# Altium project ServoBoard2018.PrjPCB
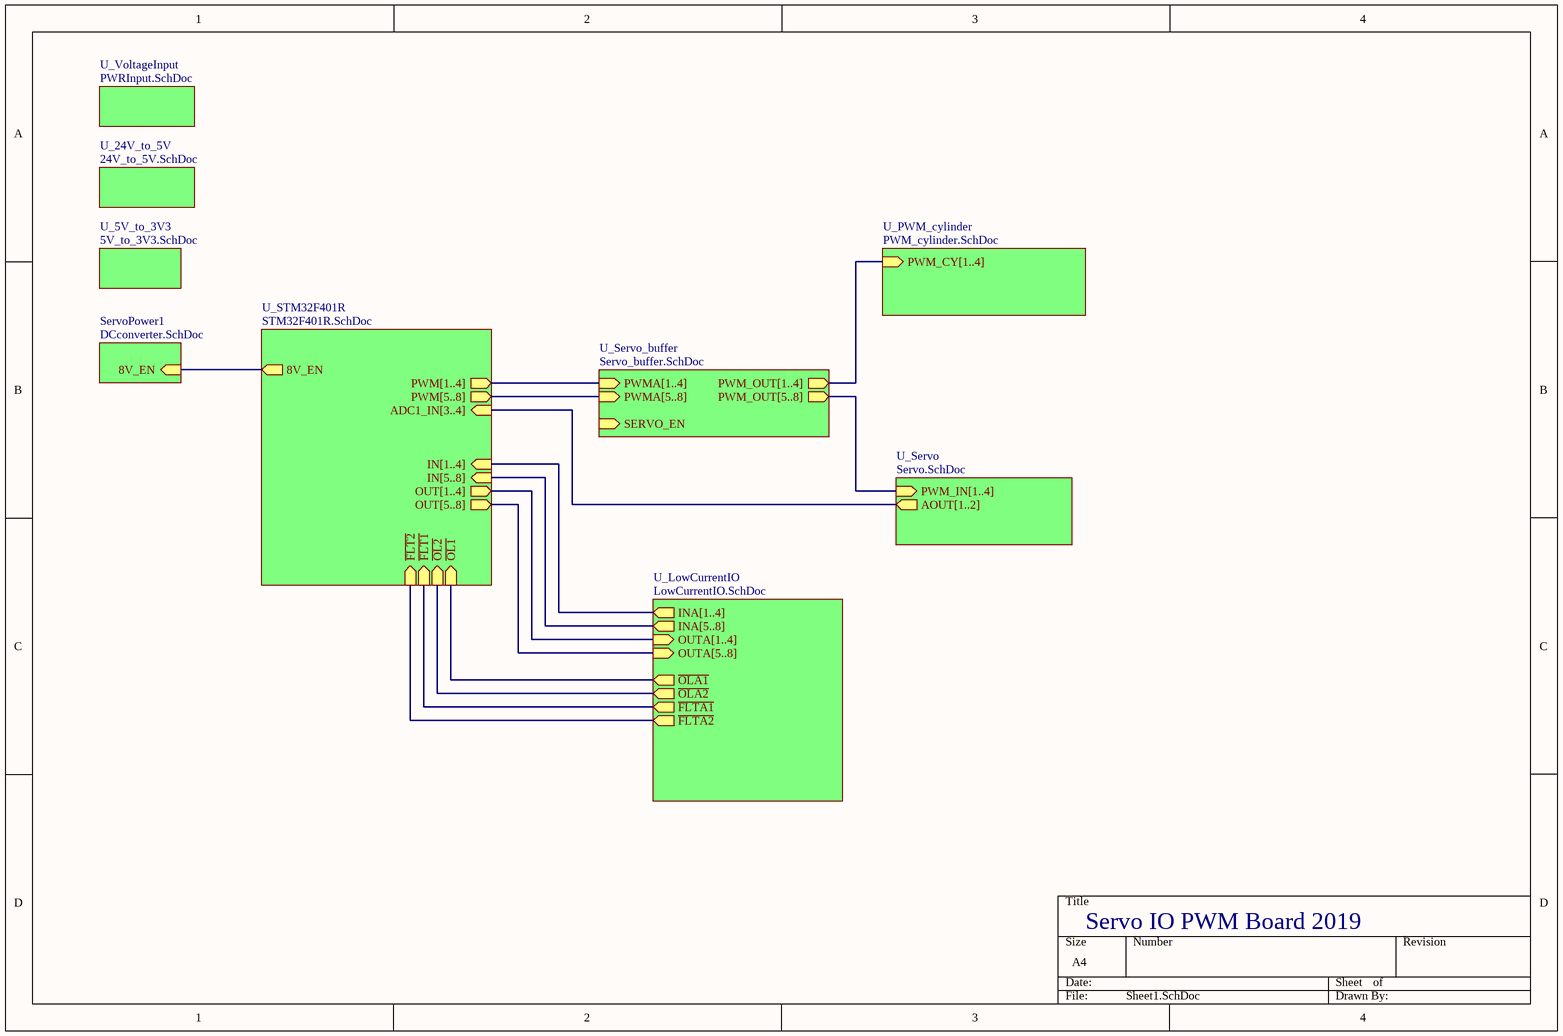
[diagram p0: Sheet1.SchDoc]
10 sheets, 113 parts. Net scope: hierarchical (ports join the sheet entries above them; power ports are global).
Board file: ServoBoard2018.PcbDoc
Sheets:
  Sheet1.SchDoc
    ServoPower1 = DCconverter.SchDoc
    U_VoltageInput = PWRInput.SchDoc
    U_24V_to_5V = 24V_to_5V.SchDoc
    U_5V_to_3V3 = 5V_to_3V3.SchDoc
    U_STM32F401R = STM32F401R.SchDoc
    U_Servo_buffer = Servo_buffer.SchDoc
    U_Servo = Servo.SchDoc
    U_PWM_cylinder = PWM_cylinder.SchDoc
    U_LowCurrentIO = LowCurrentIO.SchDoc

## Sheet Sheet1.SchDoc
size A4

### Sub-sheets
ServoPower1 = DCconverter.SchDoc: 8V_EN (in)
U_5V_to_3V3 = 5V_to_3V3.SchDoc: no entries
U_24V_to_5V = 24V_to_5V.SchDoc: no entries
U_LowCurrentIO = LowCurrentIO.SchDoc: ~{OLA2} (out), ~{FLTA1} (out), ~{FLTA2} (out), ~{OLA1} (out), INA[5..8] (out), OUTA[5..8] (in), INA[1..4] (out), OUTA[1..4] (in)
U_PWM_cylinder = PWM_cylinder.SchDoc: PWM_CY[1..4] (in)
U_Servo = Servo.SchDoc: PWM_IN[1..4] (in), AOUT[1..2] (out)
U_Servo_buffer = Servo_buffer.SchDoc: SERVO_EN (in), PWMA[5..8] (in), PWMA[1..4] (in), PWM_OUT[5..8] (out), PWM_OUT[1..4] (out)
U_STM32F401R = STM32F401R.SchDoc: ~{OL2} (in), ~{FLT1} (in), ~{FLT2} (in), ~{OL1} (in), 8V_EN (out), IN[5..8] (in), ADC1_IN[3..4] (in), PWM[1..4] (out), PWM[5..8] (out), IN[1..4] (in), OUT[1..4] (out), OUT[5..8] (out)
U_VoltageInput = PWRInput.SchDoc: no entries

### Nets
NetR7_1: sheet ServoPower1/8V_EN, sheet U_STM32F401R/8V_EN
NetU1_33: sheet U_STM32F401R/~{FLT1}, sheet U_LowCurrentIO/~{FLTA1}
NetU1_34: sheet U_STM32F401R/~{OL1}, sheet U_LowCurrentIO/~{OLA1}
NetU1_35: sheet U_STM32F401R/~{FLT2}, sheet U_LowCurrentIO/~{FLTA2}
NetU1_36: sheet U_STM32F401R/~{OL2}, sheet U_LowCurrentIO/~{OLA2}

### Buses and harness runs
bus sheet U_LowCurrentIO/INA[1..4] = sheet U_STM32F401R/IN[1..4]
bus sheet U_LowCurrentIO/INA[5..8] = sheet U_STM32F401R/IN[5..8]
bus sheet U_LowCurrentIO/OUTA[1..4] = sheet U_STM32F401R/OUT[1..4]
bus sheet U_LowCurrentIO/OUTA[5..8] = sheet U_STM32F401R/OUT[5..8]
bus sheet U_PWM_cylinder/PWM_CY[1..4] = sheet U_Servo_buffer/PWM_OUT[1..4]
bus sheet U_Servo/AOUT[1..2] = sheet U_STM32F401R/ADC1_IN[3..4]
bus sheet U_Servo/PWM_IN[1..4] = sheet U_Servo_buffer/PWM_OUT[5..8]
bus sheet U_Servo_buffer/PWMA[1..4] = sheet U_STM32F401R/PWM[1..4]
bus sheet U_Servo_buffer/PWMA[5..8] = sheet U_STM32F401R/PWM[5..8]

### Notes on the sheet
- Servo IO PWM Board 2019

## Sheet DCconverter.SchDoc
size A4
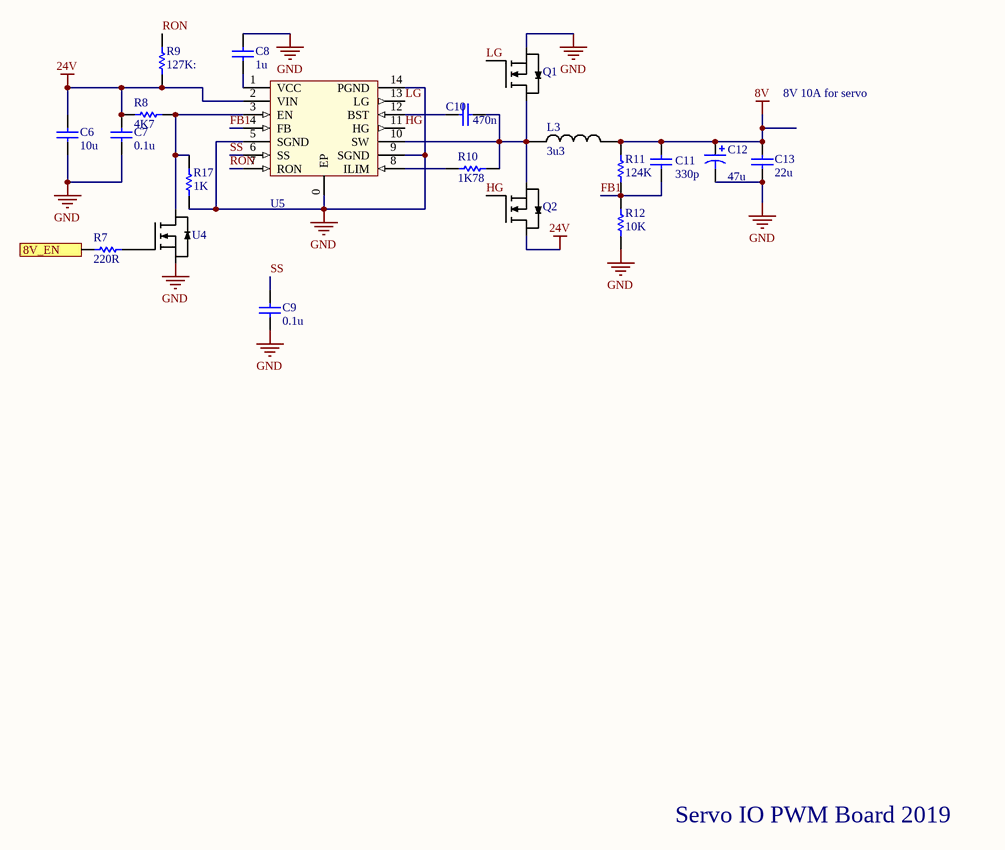
[diagram p1: DCconverter.SchDoc]

### Parts
C6  value 10u  [CAPC2012X135N]  (hidden comment: Cap)
C7  value 0.1u  [CAPC1608X90N]  (hidden comment: Cap)
C8  value 1u  [CAPC1608X90N]  (hidden comment: Cap)
C9  value 0.1u  [CAPC1608X90N]  (hidden comment: Cap)
C10  value 470n  [CAPC2012X135N]  (hidden comment: Cap)
C11  value 330p  [CAPC1608X90N]  (hidden comment: Cap)
C12  value 47u  [CAP_ELEC_SIZE_E]  (hidden comment: Cap Pol1)
C13  value 22u  [CAPC3216X100N]  (hidden comment: Cap)
L3  inductance: 3u3  [IND_7x7x3]  (hidden comment: 3.3uH 8A sat.)
Q1  60V N-Channel MOSFET  [SON_5x6_NexFET]  (value not drawn)
Q2  60V N-Channel MOSFET  [SON_5x6_NexFET]  (value not drawn)
R7  value 220R  [RESC1608X55N]  (hidden comment: Res1)
R8  value 4K7  [RESC1608X55N]  (hidden comment: Res1)
R9  value 127K:  [RESC1608X55N]  (hidden comment: Res1)
R10  value 1K78  [RESC1608X55N]  (hidden comment: Res1)
R11  value 124K  [RESC1608X55N]  (hidden comment: Res1)
R12  value 10K  [RESC1608X55N]  (hidden comment: Res1)
R17  value 1K  [RESC1608X55N]  (hidden comment: Res1)
U4  Enhancing mode mosfet  [SOT323]  (value not drawn)
U5  LM3150 buck converter  [HTSSOP14]  (value not drawn)

### Ports
8V_EN (in)

### Nets
8V: C11.2 C12.1 C13.2 L3.2 R11.2
24V: C6.2 C7.2 Q2.4(D) R8.1 R9.1 U5.2(VIN)
GND: C6.1 C7.1 C8.2 C9.1 C12.2 C13.1 Q1.3(S) R12.1 R17.1 U4.2(S) U5.0(EP) U5.5(SGND) U5.9(SGND) U5.14(PGND)
FB1: C11.1 R11.1 R12.2 U5.4(FB)
HG: Q2.1(G) U5.11(HG)
LG: Q1.1(G) U5.13(LG)
RON: R9.2 U5.7(RON)
SS: C9.2 U5.6(SS)
NetC8_1: C8.1 U5.1(VCC)
NetC10_1: C10.1 U5.12(BST)
NetC10_2: C10.2 L3.1 Q1.4(D) Q2.3(S) R10.2 U5.10(SW)
NetR7_1: R7.1 ; port 8V_EN
NetR7_2: R7.2 U4.1(G)
NetR8_2: R8.2 R17.2 U4.3(D) U5.3(EN)
NetR10_1: R10.1 U5.8(ILIM)

### Notes on the sheet
- 8V 10A for servo
- Servo IO PWM Board 2019

### Library data of the parts
C6-C11 C13 = Cap: Capacitor; Published: 8-Jun-2000; LatestRevisionDate: 17-Jul-2002; LatestRevisionNote: Re-released for DXP Platform.; PackageReference: RAD-0.3; Publisher: Altium Limited; PackageDescription: Radial Cap, Thru-Hole; 2 Leads; 0.3 in Pin Spacing
C12 = Cap Pol1: Polarized Capacitor (Radial); Published: 8-Jun-2000; LatestRevisionDate: 17-Jul-2002; LatestRevisionNote: Re-released for DXP Platform.; PackageReference: RB7.6-15; Publisher: Altium Limited; PackageDescription: Polarized Capacitor (Radial); 2 Leads
L3 = SRP6030CA-3R3M: 3.3uH inductor SMD. 8-12A Sat. Current; Current: 10A
Q1 Q2 = CSD18534Q5A: 60V N-Channel NexFET Power MOSFET. 14A minimum depending on temperature
R7-R12 R17 = Res1: Resistor; Published: 8-Jun-2000; LatestRevisionDate: 17-Jul-2002; LatestRevisionNote: Re-released for DXP Platform.; PackageReference: AXIAL-0.3; Publisher: Altium Limited; PackageDescription: Axial Device, Thru-Hole; 2 Leads; 0.3 in Pin Spacing
U4 = DMN63D8LW-13: Small N channel MOSFET as a level shifter.; Rds @ Vgs = 2.5V 250mA: 13R; Rds @ Vgs = 5V 250mA: 2.5R; Vds max: 30V; Vgs max: 20V; Id: 300mA
U5 = LM3150: VIN_MIN: 6V; VIN_MAX: 42V; Parameter 1: *

## Sheet PWRInput.SchDoc
size A4
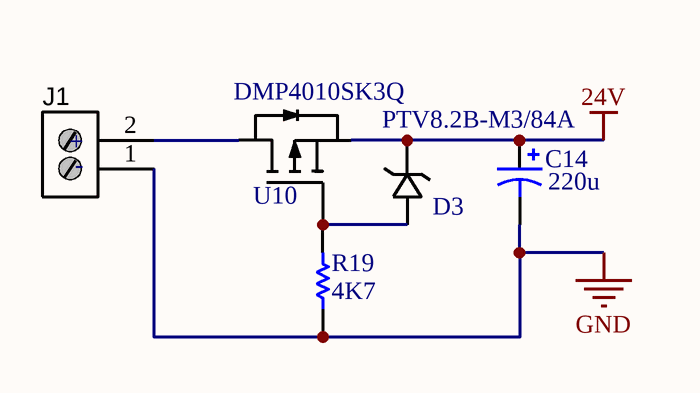
[diagram p2: PWRInput.SchDoc]

### Parts
C14  value 220u  [CAP_ELEC_SIZE_G]  (hidden comment: Cap Pol1)
D3  PTV8.2B-M3/84A  [DO-220AA]
J1  Stackable ScrewTerm  [2P_PCB_TERM]  (value not drawn)
R19  value 4K7  [RESC1608X55N]  (hidden comment: Res1)
U10  DMP4010SK3Q  [TO-252]

### Nets
24V: C14.1 D3.K U10.3(S)
GND: C14.2 J1.1 R19.1
NetD3_A: D3.A R19.2 U10.1(G)
NetJ1_2: J1.2 U10.4(D)

### Notes on the sheet
- (in symbol 2P_ScrewTerm_90S_3.81MM) +; -

### Library data of the parts
C14 = Cap Pol1: Polarized Capacitor (Radial); Published: 8-Jun-2000; LatestRevisionDate: 17-Jul-2002; LatestRevisionNote: Re-released for DXP Platform.; PackageReference: RB7.6-15; Publisher: Altium Limited; PackageDescription: Polarized Capacitor (Radial); 2 Leads
D3 = PTV8.2B-M3/84A: zener diode, Surface Mount Power Voltage-Regulating Diodes; Manufacturer: Vishay; Vz: 8.2V-9.3V; Pd: 1.5W; datasheet: http://www.mouser.com/ds/2/427/ptvxxb-100167.pdf
J1 = 2P_ScrewTerm_90S_3.81MM: Terminal Block Screw Type THT 2-Position 3.81mm pitch; Manufacturer 1: Tyco Electronics; Manufacturer Part Number 1: 1776113-2; Value: 2 position; Pitch: 0.150" (3.81mm); Positions Per Level: 2; SCDType: undef; Package / Case: Side Entry; 3.81mm pitch; Category: Connectors Interconnects; Color: Black; Supplier 1: Digi-Key; Supplier Part Number 1: A97976-ND
R19 = Res1: Resistor; Published: 8-Jun-2000; LatestRevisionDate: 17-Jul-2002; LatestRevisionNote: Re-released for DXP Platform.; PackageReference: AXIAL-0.3; Publisher: Altium Limited; PackageDescription: Axial Device, Thru-Hole; 2 Leads; 0.3 in Pin Spacing

## Sheet 24V_to_5V.SchDoc
size A4
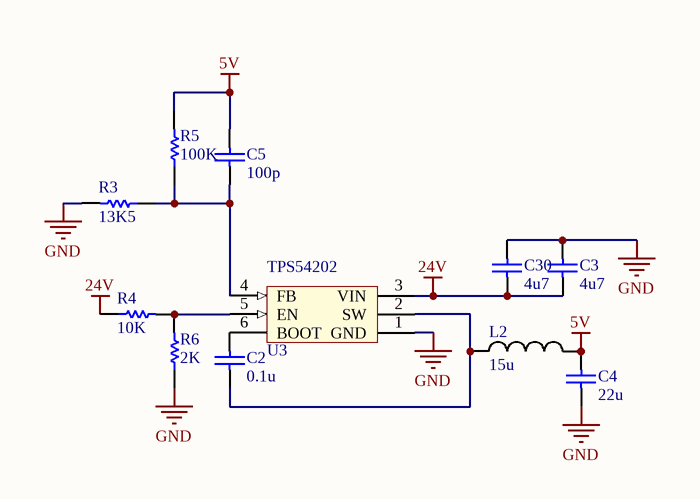
[diagram p3: 24V_to_5V.SchDoc]

### Parts
C2  value 0.1u  [CAPC1608X90N]  (hidden comment: Cap)
C3  value 4u7  [CAPC2012X135N]  (hidden comment: Cap)
C4  value 22u  [CAPC2012X135N]  (hidden comment: Cap)
C5  value 100p  [CAPC1608X90N]  (hidden comment: Cap)
C30  value 4u7  [CAPC2012X135N]  (hidden comment: Cap)
L2  value 15u  [INDC_5.5x5.3x3]  (hidden comment: 15uH inductor)
R3  value 13K5  [RESC1608X55N]  (hidden comment: Res1)
R4  value 10K  [RESC1608X55N]  (hidden comment: Res1)
R5  value 100K  [RESC1608X55N]  (hidden comment: Res1)
R6  value 2K  [RESC1608X55N]  (hidden comment: Res1)
U3  TPS54202  [SOT23-6]

### Nets
5V: C4.2 C5.2 L2.2 R5.2
24V: C3.2 C30.2 R4.1 U3.3(VIN)
GND: C3.1 C4.1 C30.1 R3.2 R6.1 U3.1(GND)
NetC2_1: C2.1 L2.1 U3.2(SW)
NetC2_2: C2.2 U3.6(BOOT)
NetC5_1: C5.1 R3.1 R5.1 U3.4(FB)
NetR4_2: R4.2 R6.2 U3.5(EN)

### Library data of the parts
C2-C5 C30 = Cap: Capacitor; Published: 8-Jun-2000; LatestRevisionDate: 17-Jul-2002; LatestRevisionNote: Re-released for DXP Platform.; PackageReference: RAD-0.3; Publisher: Altium Limited; PackageDescription: Radial Cap, Thru-Hole; 2 Leads; 0.3 in Pin Spacing
L2 = INDC_MPX1D0530L150: 15uH inductor with 2A saturation current. Dimension is 5.5 * 5.2 * 3 mm^3; Saturation Current: 2A
R3-R6 = Res1: Resistor; Published: 8-Jun-2000; LatestRevisionDate: 17-Jul-2002; LatestRevisionNote: Re-released for DXP Platform.; PackageReference: AXIAL-0.3; Publisher: Altium Limited; PackageDescription: Axial Device, Thru-Hole; 2 Leads; 0.3 in Pin Spacing
U3 = TPS54202: 4.5-28V input 2A output step down, EMI Friendly Synchronous Step Down Converter; Vin(max): 28V; Vin(min): 4.5V; Currrent: 2A

## Sheet 5V_to_3V3.SchDoc
size A4
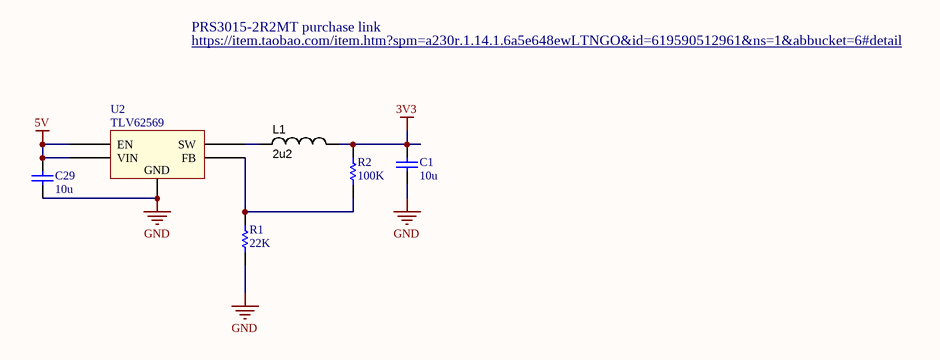
[diagram p4: 5V_to_3V3.SchDoc]

### Parts
C1  value 10u  [CAPC2012X135N]  (hidden comment: Cap)
C29  value 10u  [CAPC2012X135N]  (hidden comment: Cap)
L1  value 2u2  [INDM3225X240N]  (hidden comment: inductor)
R1  value 22K  [RESC2012X70N]  (hidden comment: Res1)
R2  value 100K  [RESC2012X70N]  (hidden comment: Res1)
U2  TLV62569  [SOT23-5]

### Nets
3V3: C1.2 L1.2 R2.2
5V: C29.2 U2.1(EN) U2.4(VIN)
GND: C1.1 C29.1 R1.2 U2.2(GND)
NetL1_1: L1.1 U2.3(SW)
NetR1_1: R1.1 R2.1 U2.5(FB)

### Notes on the sheet
- PRS3015-2R2MT purchase link
- https://item.taobao.com/item.htm?spm=a230r.1.14.1.6a5e648ewLTNGO&id=619590512961&ns=1&abbucket=6#detail

### Library data of the parts
C1 C29 = Cap: Capacitor; Published: 8-Jun-2000; LatestRevisionDate: 17-Jul-2002; LatestRevisionNote: Re-released for DXP Platform.; PackageReference: RAD-0.3; Publisher: Altium Limited; PackageDescription: Radial Cap, Thru-Hole; 2 Leads; 0.3 in Pin Spacing
L1 = INDC: IHLP SMD 4040; link: http://www.mouser.hk/ProductDetail/Panasonic/ETQ-P5M4R7YFC/?qs=sGAEpiMZZMsg%252by3WlYCkUx1BJssUTVH58rrEHsPkNus%3d
R1 R2 = Res1: Resistor; Published: 8-Jun-2000; LatestRevisionDate: 17-Jul-2002; LatestRevisionNote: Re-released for DXP Platform.; PackageReference: AXIAL-0.3; Publisher: Altium Limited; PackageDescription: Axial Device, Thru-Hole; 2 Leads; 0.3 in Pin Spacing
U2 = TLV62569: 2-A High Efficiency Synchronous Buck Converter in SOT Package; Manufacturer: TI; Vin: 2.5-5.5V; Iout(max): 2A

## Sheet STM32F401R.SchDoc
size A4
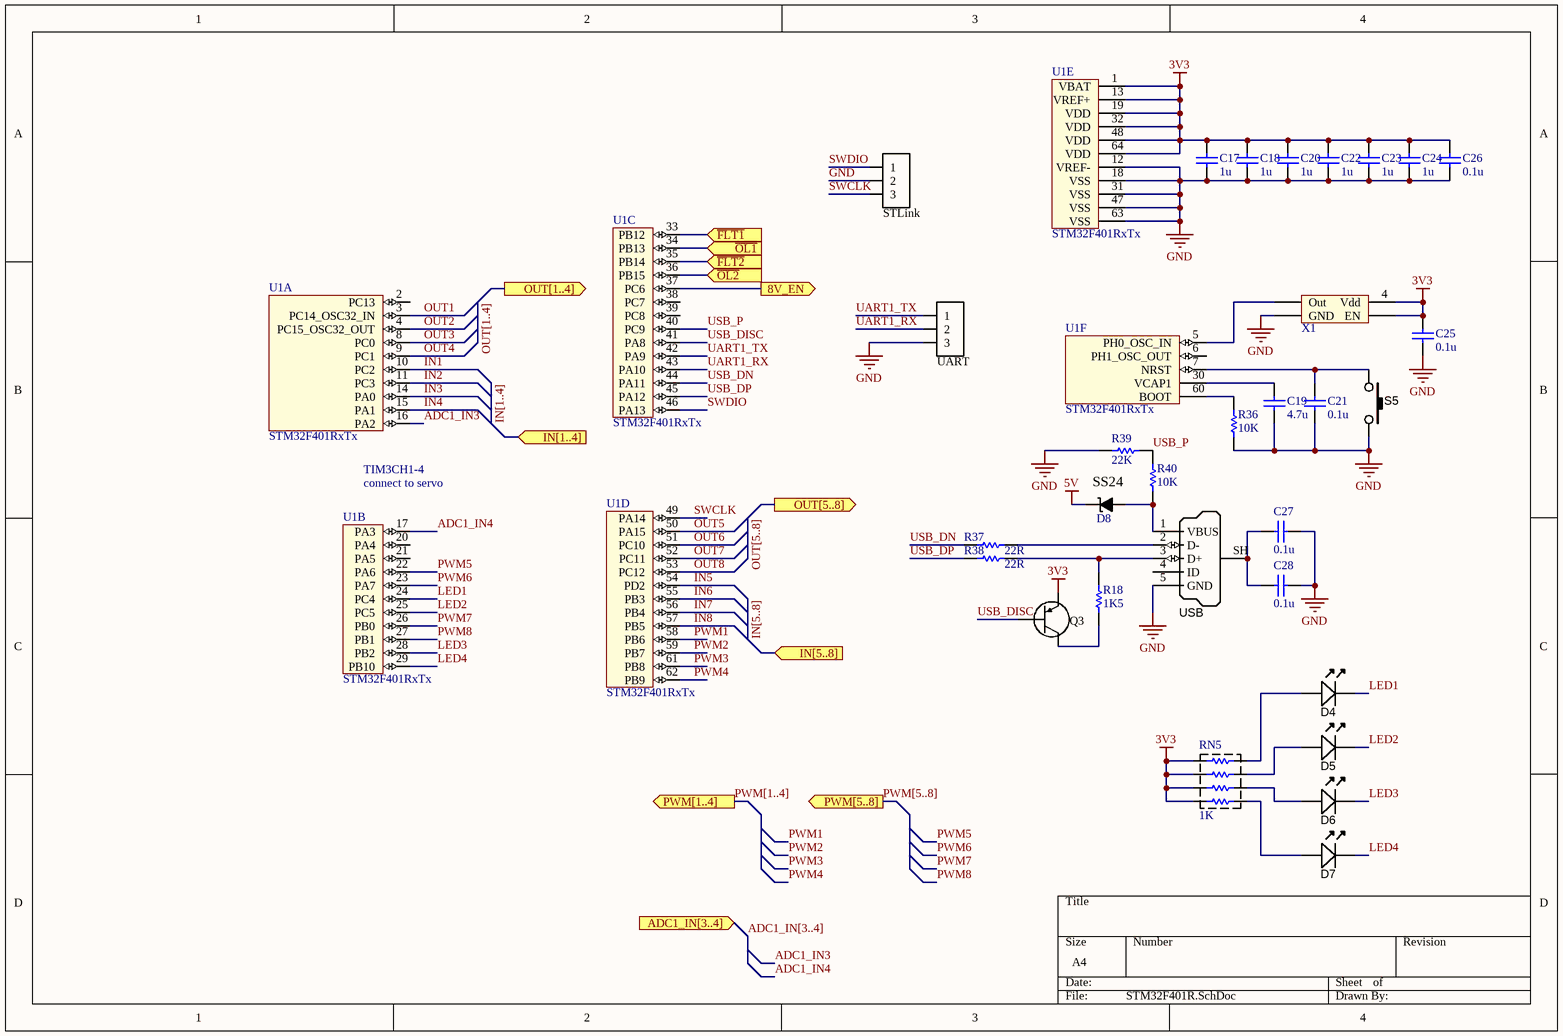
[diagram p5: STM32F401R.SchDoc]

### Parts
C17  value 1u  [CAPC1608X90N]  (hidden comment: Cap)
C18  value 1u  [CAPC1608X90N]  (hidden comment: Cap)
C19  value 4.7u  [CAPC1608X90N]  (hidden comment: Cap)
C20  value 1u  [CAPC1608X90N]  (hidden comment: Cap)
C21  value 0.1u  [CAPC1608X90N]  (hidden comment: Cap)
C22  value 1u  [CAPC1608X90N]  (hidden comment: Cap)
C23  value 1u  [CAPC1608X90N]  (hidden comment: Cap)
C24  value 1u  [CAPC1608X90N]  (hidden comment: Cap)
C25  value 0.1u  [CAPC1608X90N]  (hidden comment: Cap)
C26  value 0.1u  [CAPC1608X90N]  (hidden comment: Cap)
C27  value 0.1u  [CAPC1608X90N]  (hidden comment: Cap)
C28  value 0.1u  [CAPC1608X90N]  (hidden comment: Cap)
D4  LED_Green_GullWing  [LED-0805-A]  (value not drawn)
D5  LED_Green_GullWing  [LED-0805-A]  (value not drawn)
D6  LED_Green_GullWing  [LED-0805-A]  (value not drawn)
D7  LED_Green_GullWing  [LED-0805-A]  (value not drawn)
D8  MBRA210LT3G  [SMA]  (value not drawn)
Q3  DTA114YYUA  [SOT323]  (value not drawn)
R18  value 1K5  [RESC1608X55N]  (hidden comment: Res1)
R36  value 10K  [RESC1608X55N]  (hidden comment: Res1)
R37  value 22R  [RESC1608X55N]  (hidden comment: Res1)
R38  value 22R  [RESC1608X55N]  (hidden comment: Res1)
R39  value 22K  [RESC1608X55N]  (hidden comment: Res1)
R40  value 10K  [RESC1608X55N]  (hidden comment: Res1)
RN5  value 1K  [RESCAXS50P160X320X70-8N]  (hidden comment: resistor network)
S5  SW_THT_PB_4.3mm  [TACT_SWT-SMD-4.4]  (value not drawn)
STLink  Header  [1x3POS_HEADER]  (value not drawn)
U1  STM32F401RxTx  [LQFP64]  (parts A,B,C,D,E,F of 6)
UART  Header  [1x3POS_HEADER]  (value not drawn)
USB  USB Micro Type B  [USB_MICRO-B]  (value not drawn)
X1  ASV-8.000MHZ-EJ-T  [ASV SERIES]  (value not drawn)

### Ports
8V_EN (out), ADC1_IN[3..4] (in), IN[1..4] (in), IN[5..8] (in), OUT[1..4] (out), OUT[5..8] (out), PWM[1..4] (out), PWM[5..8] (out), ~{FLT1} (in), ~{FLT2} (in), ~{OL1} (in), ~{OL2} (in)

### Nets
3V3: C17.2 C18.2 C20.2 C22.2 C23.2 C24.2 C25.2 C26.2 Q3.2(E) RN5.1 RN5.2 RN5.3 RN5.4 U1.1(VBAT) U1.13(VREF+) U1.19(VDD) U1.32(VDD) U1.48(VDD) U1.64(VDD) X1.1(EN) X1.4(Vdd)
5V: D8.K(Cathode)
GND: C17.1 C18.1 C19.1 C20.1 C21.1 C22.1 C23.1 C24.1 C25.1 C26.1 C27.2 C28.2 R36.1 R39.2 S5.2 STLink.2 U1.12(VREF-) U1.18(VSS) U1.31(VSS) U1.47(VSS) U1.63(VSS) UART.3 USB.5(GND) X1.2(GND)
ADC1_IN3: U1.16(PA2)
ADC1_IN4: U1.17(PA3)
IN1: U1.10(PC2)
IN2: U1.11(PC3)
IN3: U1.14(PA0)
IN4: U1.15(PA1)
IN5: U1.54(PD2)
IN6: U1.55(PB3)
IN7: U1.56(PB4)
IN8: U1.57(PB5)
LED1: D4.K U1.24(PC4)
LED2: D5.K U1.25(PC5)
LED3: D6.K U1.28(PB2)
LED4: D7.K U1.29(PB10)
OUT1: U1.3(PC14_OSC32_IN)
OUT2: U1.4(PC15_OSC32_OUT)
OUT3: U1.8(PC0)
OUT4: U1.9(PC1)
OUT5: U1.50(PA15)
OUT6: U1.51(PC10)
OUT7: U1.52(PC11)
OUT8: U1.53(PC12)
PWM1: U1.58(PB6)
PWM2: U1.59(PB7)
PWM3: U1.61(PB8)
PWM4: U1.62(PB9)
PWM5: U1.22(PA6)
PWM6: U1.23(PA7)
PWM7: U1.26(PB0)
PWM8: U1.27(PB1)
SWCLK: STLink.3 U1.49(PA14)
SWDIO: STLink.1 U1.46(PA13)
UART1_RX: U1.43(PA10) UART.2
UART1_TX: U1.42(PA9) UART.1
USB_DISC: Q3.1(B) U1.41(PA8)
USB_DN: R37.1 U1.44(PA11)
USB_DP: R38.1 U1.45(PA12)
USB_P: R39.1 R40.2 U1.40(PC9)
NetC19_2: C19.2 U1.30(VCAP1)
NetC21_2: C21.2 S5.1 U1.7(NRST)
NetC27_1: C27.1 C28.1 USB.SH(Shell)
NetD4_A: D4.A RN5.8
NetD5_A: D5.A RN5.7
NetD6_A: D6.A RN5.6
NetD7_A: D7.A RN5.5
NetD8_A: D8.A(Anode) R40.1 USB.1(VBUS)
NetQ3_3: Q3.3(C) R18.1
NetR7_1: U1.37(PC6) ; port 8V_EN
NetR18_2: R18.2 R38.2 USB.3(D+)
NetR36_2: R36.2 U1.60(BOOT)
NetR37_2: R37.2 USB.2(D-)
NetU1_5: U1.5(PH0_OSC_IN) X1.3(Out)
NetU1_33: U1.33(PB12) ; port ~{FLT1}
NetU1_34: U1.34(PB13) ; port ~{OL1}
NetU1_35: U1.35(PB14) ; port ~{FLT2}
NetU1_36: U1.36(PB15) ; port ~{OL2}

Not connected (* = marked no-connect by the designer): U1 2(PC13) 6(PH1_OSC_OUT) 20(PA4) 21(PA5) 38(PC7) 39(PC8); USB 4(ID)

### Buses and harness runs
bus ADC1_IN[3..4] = port ADC1_IN[3..4]
bus IN[1..4] = port IN[1..4]
bus IN[5..8] = port IN[5..8]
bus OUT[1..4] = port OUT[1..4]
bus OUT[5..8] = port OUT[5..8]
bus PWM[1..4] = port PWM[1..4]
bus PWM[5..8] = port PWM[5..8]

### Notes on the sheet
- (near U1) TIM3CH1-4
- (near U1) connect to servo
- SS24

### Library data of the parts
C17-C28 = Cap: Capacitor; Published: 8-Jun-2000; LatestRevisionDate: 17-Jul-2002; LatestRevisionNote: Re-released for DXP Platform.; PackageReference: RAD-0.3; Publisher: Altium Limited; PackageDescription: Radial Cap, Thru-Hole; 2 Leads; 0.3 in Pin Spacing
D4-D7 = LED_Green_GullWing: LED Gull-wing SMD High-intensity Green 450mcd 574nm; Manufacturer 1: Ligitek; Manufacturer Part Number 1: L8UG9033/TR1; Ratings: 450 mcd; 574 nm; Material: AlGaInP; SCDType: source; Package / Case: 4.6mm Gull-Wing; Color: Green
D8 = MBRA210LT3G: Surface Mount  Schottky Power Rectifier; Manufacturer: ON semiconductor; Vf: 350mV; If: 2A; Vrrm: 10V; datasheet: http://www.mouser.com/ds/2/308/MBRA210LT3-D-76406.pdf
Q3 = DTA114YYUA: PNP -100mA -50V Digital Transistor (Bias Resistor Built-in Transistor); Manufacturer: ROHM
R18 R36-R40 = Res1: Resistor; Published: 8-Jun-2000; LatestRevisionDate: 17-Jul-2002; LatestRevisionNote: Re-released for DXP Platform.; PackageReference: AXIAL-0.3; Publisher: Altium Limited; PackageDescription: Axial Device, Thru-Hole; 2 Leads; 0.3 in Pin Spacing
RN5 = RES_NET
S5 = SW_THT_PB_4.3mm: Switch, tact, 4.3mm stem; Manufacturer 1: Bond-Tact; Manufacturer Part Number 1: TS-1143-WP-300; SCDType: spec; Function: Speed; Package / Case: 6.5x6.5mm; 4.3mm stem; Material: Brass/Nylon/Ag plating
STLink UART = Header3P: Header 3-pin
USB = USB_Micro_TypeB: Connector SMD USB Micro Type B middle mount; Manufacturer 1: Molex Inc; Manufacturer Part Number 1: 47491-0001; SCDType: undef; Package / Case: SMD; Supplier 1: Digi-Key; Supplier Part Number 1: WM17142CT-ND
X1 = ASV-8.000MHZ-EJ-T: 3.3Vdc HCMOS SMD Crystal Clock Oscillator; Manufacturer: Abracon; VDD: 3.3V; Frequency: 8.000MHz

## Sheet Servo_buffer.SchDoc
size A4
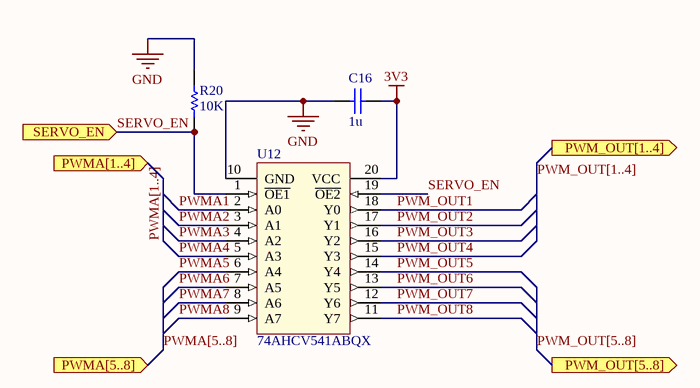
[diagram p6: Servo_buffer.SchDoc]

### Parts
C16  value 1u  [CAPC1608X90N]  (hidden comment: Cap)
R20  value 10K  [RESC1608X55N]  (hidden comment: Res1)
U12  74AHCV541ABQX  [TSSOP20_4.4mm]

### Ports
PWM_OUT[1..4] (out), PWM_OUT[5..8] (out), PWMA[1..4] (in), PWMA[5..8] (in), SERVO_EN (in)

### Nets
3V3: C16.2 U12.20(VCC)
GND: C16.1 R20.2 U12.10(GND)
PWM_OUT1: U12.18(Y0)  [project net PWM_CY1]
PWM_OUT2: U12.17(Y1)  [project net PWM_CY2]
PWM_OUT3: U12.16(Y2)  [project net PWM_CY3]
PWM_OUT4: U12.15(Y3)  [project net PWM_CY4]
PWM_OUT5: U12.14(Y4)  [project net PWM_IN1]
PWM_OUT6: U12.13(Y5)  [project net PWM_IN2]
PWM_OUT7: U12.12(Y6)  [project net PWM_IN3]
PWM_OUT8: U12.11(Y7)  [project net PWM_IN4]
PWMA1: U12.2(A0)  [project net PWM1]
PWMA2: U12.3(A1)  [project net PWM2]
PWMA3: U12.4(A2)  [project net PWM3]
PWMA4: U12.5(A3)  [project net PWM4]
PWMA5: U12.6(A4)  [project net PWM5]
PWMA6: U12.7(A5)  [project net PWM6]
PWMA7: U12.8(A6)  [project net PWM7]
PWMA8: U12.9(A7)  [project net PWM8]
SERVO_EN: R20.1 U12.1(~{OE1}) U12.19(~{OE2}) ; port SERVO_EN

### Buses and harness runs
bus PWM_OUT[1..4] = port PWM_OUT[1..4]
bus PWM_OUT[5..8] = port PWM_OUT[5..8]
bus PWMA[1..4] = port PWMA[1..4]
bus PWMA[5..8] = port PWMA[5..8]

### Library data of the parts
C16 = Cap: Capacitor; Published: 8-Jun-2000; LatestRevisionDate: 17-Jul-2002; LatestRevisionNote: Re-released for DXP Platform.; PackageReference: RAD-0.3; Publisher: Altium Limited; PackageDescription: Radial Cap, Thru-Hole; 2 Leads; 0.3 in Pin Spacing
R20 = Res1: Resistor; Published: 8-Jun-2000; LatestRevisionDate: 17-Jul-2002; LatestRevisionNote: Re-released for DXP Platform.; PackageReference: AXIAL-0.3; Publisher: Altium Limited; PackageDescription: Axial Device, Thru-Hole; 2 Leads; 0.3 in Pin Spacing
U12 = 74AHCV541ABQX: Octal buffer/line driver; 3-state; Source: https://www.mouser.hk/ProductDetail/Nexperia/74AHCV244APWJ?qs=sGAEpiMZZMuiiWkaIwCK2bgmxBV%2FR64eEE4cbZSq%2Ff0=; ComponentLink1Description: purchase; ComponentLink1URL: https://www.mouser.hk/ProductDetail/Nexperia/74AHCV244APWJ?qs=sGAEpiMZZMuiiWkaIwCK2bgmxBV%2FR64eEE4cbZSq%2Ff0=

## Sheet Servo.SchDoc
size A4
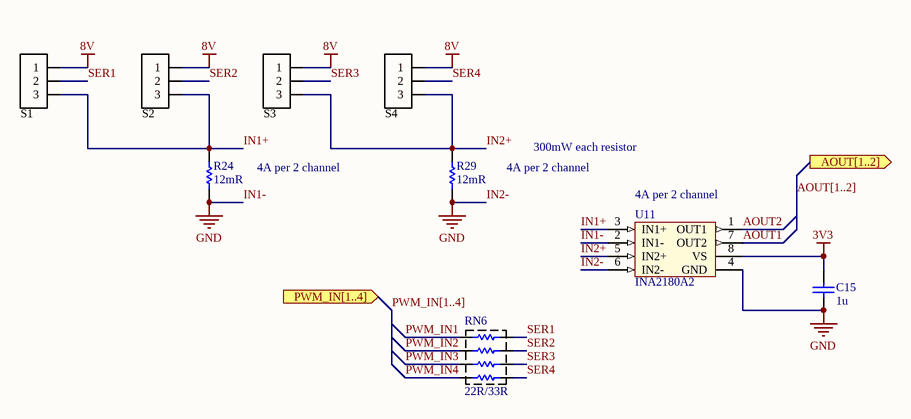
[diagram p7: Servo.SchDoc]

### Parts
C15  value 1u  [CAPC1608X90N]  (hidden comment: Cap)
R24  value 12mR  [RESC2012X70N]  (hidden comment: Res1)
R29  value 12mR  [RESC2012X70N]  (hidden comment: Res1)
RN6  value 22R/33R  [RESCAXS50P160X320X70-8N]  (hidden comment: resistor network)
S1  Header  [1x3POS_HEADER]  (value not drawn)
S2  Header  [1x3POS_HEADER]  (value not drawn)
S3  Header  [1x3POS_HEADER]  (value not drawn)
S4  Header  [1x3POS_HEADER]  (value not drawn)
U11  INA2180A2  [VSSOP8]

### Ports
AOUT[1..2] (out), PWM_IN[1..4] (in)

### Nets
3V3: C15.2 U11.8(VS)
8V: S1.1 S2.1 S3.1 S4.1
GND: C15.1 R24.1 R29.1 U11.2(IN1-) U11.4(GND) U11.6(IN2-)  [also labelled IN1-, IN2-]
AOUT1: U11.7(OUT2)  [project net ADC1_IN3]
AOUT2: U11.1(OUT1)  [project net ADC1_IN4]
IN1+: R24.2 S1.3 S2.3 U11.3(IN1+)
IN2+: R29.2 S3.3 S4.3 U11.5(IN2+)
PWM_IN1: RN6.1
PWM_IN2: RN6.2
PWM_IN3: RN6.3
PWM_IN4: RN6.4
SER1: RN6.8 S1.2
SER2: RN6.7 S2.2
SER3: RN6.6 S3.2
SER4: RN6.5 S4.2

### Buses and harness runs
bus AOUT[1..2] = port AOUT[1..2]
bus PWM_IN[1..4] = port PWM_IN[1..4]

### Notes on the sheet
- 4A per 2 channel
- 300mW each resistor
- (near U11) 4A per 2 channel

### Library data of the parts
C15 = Cap: Capacitor; Published: 8-Jun-2000; LatestRevisionDate: 17-Jul-2002; LatestRevisionNote: Re-released for DXP Platform.; PackageReference: RAD-0.3; Publisher: Altium Limited; PackageDescription: Radial Cap, Thru-Hole; 2 Leads; 0.3 in Pin Spacing
R24 R29 = Res1: Resistor; Published: 8-Jun-2000; LatestRevisionDate: 17-Jul-2002; LatestRevisionNote: Re-released for DXP Platform.; PackageReference: AXIAL-0.3; Publisher: Altium Limited; PackageDescription: Axial Device, Thru-Hole; 2 Leads; 0.3 in Pin Spacing
RN6 = RES_NET
S1-S4 = Header3P: Header 3-pin
U11 = INA2180A2: Dual channel current amplifier with 50V/V gain; VIN: 2.7-5.5V; ComponentLink1Description: purchase; ComponentLink1URL: https://www.mouser.com/ProductDetail/Texas-Instruments/INA2180A1IDGKR?qs=sGAEpiMZZMve4%2FbfQkoj%252BJeFFT10xS5SspuFDeMRQ2U%3D; Gain: 50V/V

## Sheet PWM_cylinder.SchDoc
size A4
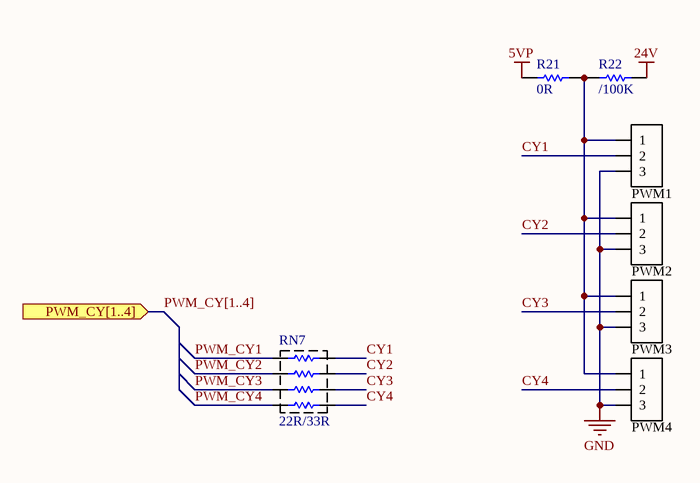
[diagram p8: PWM_cylinder.SchDoc]

### Parts
PWM1  Header  [1x3POS_HEADER]  (value not drawn)
PWM2  Header  [1x3POS_HEADER]  (value not drawn)
PWM3  Header  [1x3POS_HEADER]  (value not drawn)
PWM4  Header  [1x3POS_HEADER]  (value not drawn)
R21  value 0R  [RESC1608X55N]  (hidden comment: Res1)
R22  value /100K  [RESC1608X55N]  (hidden comment: Res1)
RN7  value 22R/33R  [RESCAXS50P160X320X70-8N]  (hidden comment: resistor network)

### Ports
PWM_CY[1..4] (in)

### Nets
5VP: R21.2
24V: R22.1
GND: PWM1.3 PWM2.3 PWM3.3 PWM4.3
CY1: PWM1.2 RN7.8
CY2: PWM2.2 RN7.7
CY3: PWM3.2 RN7.6
CY4: PWM4.2 RN7.5
PWM_CY1: RN7.1
PWM_CY2: RN7.2
PWM_CY3: RN7.3
PWM_CY4: RN7.4
NetPWM1_1: PWM1.1 PWM2.1 PWM3.1 PWM4.1 R21.1 R22.2

### Buses and harness runs
bus PWM_CY[1..4] = port PWM_CY[1..4]

### Library data of the parts
PWM1-PWM4 = Header3P: Header 3-pin
R21 R22 = Res1: Resistor; Published: 8-Jun-2000; LatestRevisionDate: 17-Jul-2002; LatestRevisionNote: Re-released for DXP Platform.; PackageReference: AXIAL-0.3; Publisher: Altium Limited; PackageDescription: Axial Device, Thru-Hole; 2 Leads; 0.3 in Pin Spacing
RN7 = RES_NET

## Sheet LowCurrentIO.SchDoc
size A4
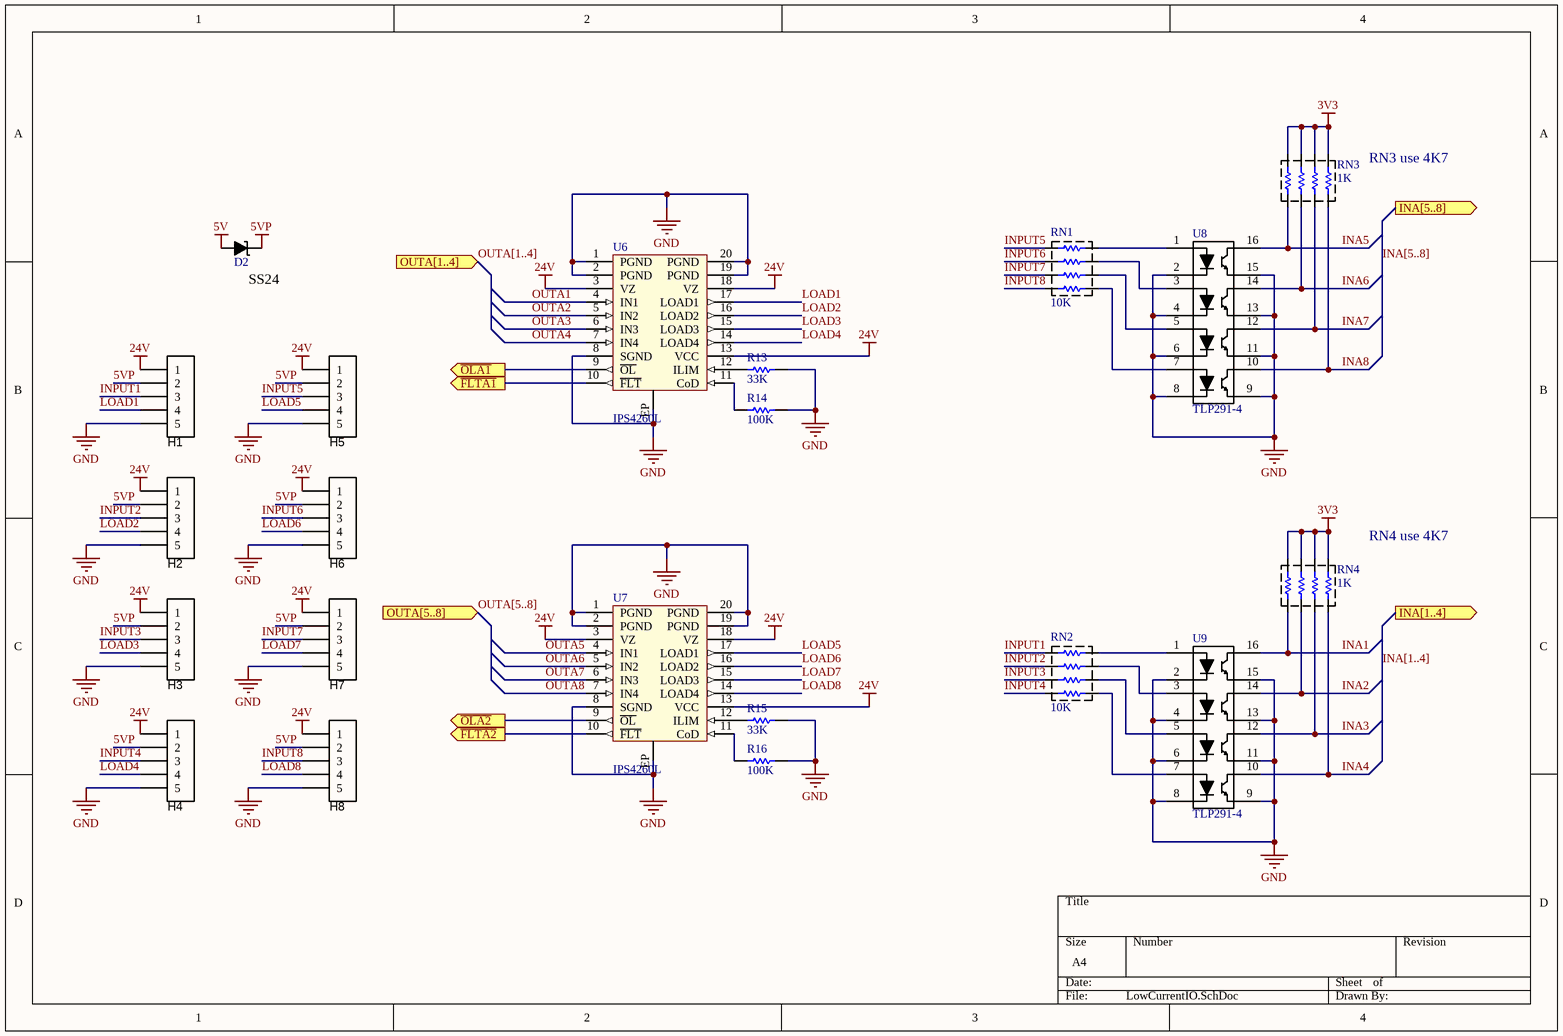
[diagram p9: LowCurrentIO.SchDoc]

### Parts
D2  MBRA210LT3G  [SMA]  (value not drawn)
H1  Programmer  [HDR_1X5_2.54MM _TE_CONC]  (value not drawn)  (no BOM)
H2  Programmer  [HDR_1X5_2.54MM _TE_CONC]  (value not drawn)  (no BOM)
H3  Programmer  [HDR_1X5_2.54MM _TE_CONC]  (value not drawn)  (no BOM)
H4  Programmer  [HDR_1X5_2.54MM _TE_CONC]  (value not drawn)  (no BOM)
H5  Programmer  [HDR_1X5_2.54MM _TE_CONC]  (value not drawn)  (no BOM)
H6  Programmer  [HDR_1X5_2.54MM _TE_CONC]  (value not drawn)  (no BOM)
H7  Programmer  [HDR_1X5_2.54MM _TE_CONC]  (value not drawn)  (no BOM)
H8  Programmer  [HDR_1X5_2.54MM _TE_CONC]  (value not drawn)  (no BOM)
R13  value 33K  [RESC1608X55N]  (hidden comment: Res1)
R14  value 100K  [RESC1608X55N]  (hidden comment: Res1)
R15  value 33K  [RESC1608X55N]  (hidden comment: Res1)
R16  value 100K  [RESC1608X55N]  (hidden comment: Res1)
RN1  value 10K  [RESCAXS50P160X320X70-8N]  (hidden comment: resistor network)
RN2  value 10K  [RESCAXS50P160X320X70-8N]  (hidden comment: resistor network)
RN3  value 1K  [RESCAXS50P160X320X70-8N]  (hidden comment: resistor network)
RN4  value 1K  [RESCAXS50P160X320X70-8N]  (hidden comment: resistor network)
U6  IPS4260L  [HTSSOP20]
U7  IPS4260L  [HTSSOP20]
U8  TLP291-4  [SOP16]
U9  TLP291-4  [SOP16]

### Ports
INA[1..4] (out), INA[5..8] (out), OUTA[1..4] (in), OUTA[5..8] (in), ~{FLTA1} (out), ~{FLTA2} (out), ~{OLA1} (out), ~{OLA2} (out)

### Nets
3V3: RN3.5 RN3.6 RN3.7 RN3.8 RN4.5 RN4.6 RN4.7 RN4.8
5V: D2.A(Anode)
5VP: D2.K(Cathode) H1.2 H2.2 H3.2 H4.2 H5.2 H6.2 H7.2 H8.2
24V: H1.1 H2.1 H3.1 H4.1 H5.1 H6.1 H7.1 H8.1 U6.3(VZ) U6.13(VCC) U6.18(VZ) U7.3(VZ) U7.13(VCC) U7.18(VZ)
GND: H1.5 H2.5 H3.5 H4.5 H5.5 H6.5 H7.5 H8.5 R13.1 R14.1 R15.1 R16.1 U6.1(PGND) U6.2(PGND) U6.8(SGND) U6.19(PGND) U6.20(PGND) U6.EP U7.1(PGND) U7.2(PGND) U7.8(SGND) U7.19(PGND) U7.20(PGND) U7.EP U8.2 U8.4 U8.6 U8.8 U8.9 U8.11 U8.13 U8.15 U9.2 U9.4 U9.6 U9.8 U9.9 U9.11 U9.13 U9.15
INA1: RN4.1 U9.16  [project net IN1]
INA2: RN4.2 U9.14  [project net IN2]
INA3: RN4.3 U9.12  [project net IN3]
INA4: RN4.4 U9.10  [project net IN4]
INA5: RN3.1 U8.16  [project net IN5]
INA6: RN3.2 U8.14  [project net IN6]
INA7: RN3.3 U8.12  [project net IN7]
INA8: RN3.4 U8.10  [project net IN8]
INPUT1: H1.3 RN2.5
INPUT2: H2.3 RN2.6
INPUT3: H3.3 RN2.7
INPUT4: H4.3 RN2.8
INPUT5: H5.3 RN1.5
INPUT6: H6.3 RN1.6
INPUT7: H7.3 RN1.7
INPUT8: H8.3 RN1.8
LOAD1: H1.4 U6.17(LOAD1)
LOAD2: H2.4 U6.16(LOAD2)
LOAD3: H3.4 U6.15(LOAD3)
LOAD4: H4.4 U6.14(LOAD4)
LOAD5: H5.4 U7.17(LOAD1)
LOAD6: H6.4 U7.16(LOAD2)
LOAD7: H7.4 U7.15(LOAD3)
LOAD8: H8.4 U7.14(LOAD4)
OUTA1: U6.4(IN1)  [project net OUT1]
OUTA2: U6.5(IN2)  [project net OUT2]
OUTA3: U6.6(IN3)  [project net OUT3]
OUTA4: U6.7(IN4)  [project net OUT4]
OUTA5: U7.4(IN1)  [project net OUT5]
OUTA6: U7.5(IN2)  [project net OUT6]
OUTA7: U7.6(IN3)  [project net OUT7]
OUTA8: U7.7(IN4)  [project net OUT8]
NetR13_2: R13.2 U6.12(ILIM)
NetR14_2: R14.2 U6.11(CoD)
NetR15_2: R15.2 U7.12(ILIM)
NetR16_2: R16.2 U7.11(CoD)
NetRN1_1: RN1.1 U8.7
NetRN1_2: RN1.2 U8.5
NetRN1_3: RN1.3 U8.3
NetRN1_4: RN1.4 U8.1
NetRN2_1: RN2.1 U9.7
NetRN2_2: RN2.2 U9.5
NetRN2_3: RN2.3 U9.3
NetRN2_4: RN2.4 U9.1
NetU1_33: U6.10(~{FLT}) ; port ~{FLTA1}
NetU1_34: U6.9(~{OL}) ; port ~{OLA1}
NetU1_35: U7.10(~{FLT}) ; port ~{FLTA2}
NetU1_36: U7.9(~{OL}) ; port ~{OLA2}

### Buses and harness runs
bus INA[1..4] = port INA[1..4]
bus INA[5..8] = port INA[5..8]
bus OUTA[1..4] = port OUTA[1..4]
bus OUTA[5..8] = port OUTA[5..8]

### Notes on the sheet
- (near RN3) RN3 use 4K7
- (near D2) SS24
- (near RN4) RN4 use 4K7

### Library data of the parts
D2 = MBRA210LT3G: as D8 on sheet STM32F401R; datasheet: http://www.mouser.com/ds/2/308/MBRA210LT3-D-76406.pdf
H1-H8 = Header5P: Header 5-pin
R13-R16 = Res1: Resistor; Published: 8-Jun-2000; LatestRevisionDate: 17-Jul-2002; LatestRevisionNote: Re-released for DXP Platform.; PackageReference: AXIAL-0.3; Publisher: Altium Limited; PackageDescription: Axial Device, Thru-Hole; 2 Leads; 0.3 in Pin Spacing
RN1-RN4 = RES_NET
U6 U7 = IPS4260L: IPS4260L Quad low side power switch; RDS(on)@25C: 260mR; Current per 1 ch: 0.5A; Vcc: 8-50V; RDS(on)@125C: 560mR; datasheet: https://www.mouser.hk/datasheet/2/389/ips4260l-1310053.pdf
U8 U9 = TLP291-4: Link: https://www.mouser.hk/ProductDetail/Toshiba/TLP291-4GB-TPE?qs=sGAEpiMZZMteimceiIVCB3qZhEwbmgeEa%252BDKcYuRaWM=; Parameter 1: *

## Nets that join several sheets
3V3: 5V_to_3V3 (C1.2 L1.2 R2.2), STM32F401R (21 pins), Servo_buffer (C16.2 U12.20), Servo (C15.2 U11.8), LowCurrentIO (8 pins)
5V: 24V_to_5V (C4.2 C5.2 L2.2 R5.2), 5V_to_3V3 (C29.2 U2.1 U2.4), STM32F401R (D8.K), LowCurrentIO (D2.A)
5VP: PWM_cylinder (R21.2), LowCurrentIO (9 pins)
8V: DCconverter (5 pins), Servo (S1.1 S2.1 S3.1 S4.1)
24V: DCconverter (6 pins), PWRInput (C14.1 D3.K U10.3), 24V_to_5V (C3.2 C30.2 R4.1 U3.3), PWM_cylinder (R22.1), LowCurrentIO (14 pins)
GND: DCconverter (14 pins), PWRInput (C14.2 J1.1 R19.1), 24V_to_5V (6 pins), 5V_to_3V3 (C1.1 C29.1 R1.2 U2.2), STM32F401R (24 pins), Servo_buffer (C16.1 R20.2 U12.10), Servo (6 pins), PWM_cylinder (PWM1.3 PWM2.3 PWM3.3 PWM4.3), LowCurrentIO (40 pins)
ADC1_IN3: STM32F401R (U1.16), Servo (U11.7)
ADC1_IN4: STM32F401R (U1.17), Servo (U11.1)
IN1: STM32F401R (U1.10), LowCurrentIO (RN4.1 U9.16)
IN2: STM32F401R (U1.11), LowCurrentIO (RN4.2 U9.14)
IN3: STM32F401R (U1.14), LowCurrentIO (RN4.3 U9.12)
IN4: STM32F401R (U1.15), LowCurrentIO (RN4.4 U9.10)
IN5: STM32F401R (U1.54), LowCurrentIO (RN3.1 U8.16)
IN6: STM32F401R (U1.55), LowCurrentIO (RN3.2 U8.14)
IN7: STM32F401R (U1.56), LowCurrentIO (RN3.3 U8.12)
IN8: STM32F401R (U1.57), LowCurrentIO (RN3.4 U8.10)
NetR7_1: DCconverter (R7.1), STM32F401R (U1.37)
NetU1_33: STM32F401R (U1.33), LowCurrentIO (U6.10)
NetU1_34: STM32F401R (U1.34), LowCurrentIO (U6.9)
NetU1_35: STM32F401R (U1.35), LowCurrentIO (U7.10)
NetU1_36: STM32F401R (U1.36), LowCurrentIO (U7.9)
OUT1: STM32F401R (U1.3), LowCurrentIO (U6.4)
OUT2: STM32F401R (U1.4), LowCurrentIO (U6.5)
OUT3: STM32F401R (U1.8), LowCurrentIO (U6.6)
OUT4: STM32F401R (U1.9), LowCurrentIO (U6.7)
OUT5: STM32F401R (U1.50), LowCurrentIO (U7.4)
OUT6: STM32F401R (U1.51), LowCurrentIO (U7.5)
OUT7: STM32F401R (U1.52), LowCurrentIO (U7.6)
OUT8: STM32F401R (U1.53), LowCurrentIO (U7.7)
PWM1: STM32F401R (U1.58), Servo_buffer (U12.2)
PWM2: STM32F401R (U1.59), Servo_buffer (U12.3)
PWM3: STM32F401R (U1.61), Servo_buffer (U12.4)
PWM4: STM32F401R (U1.62), Servo_buffer (U12.5)
PWM5: STM32F401R (U1.22), Servo_buffer (U12.6)
PWM6: STM32F401R (U1.23), Servo_buffer (U12.7)
PWM7: STM32F401R (U1.26), Servo_buffer (U12.8)
PWM8: STM32F401R (U1.27), Servo_buffer (U12.9)
PWM_CY1: Servo_buffer (U12.18), PWM_cylinder (RN7.1)
PWM_CY2: Servo_buffer (U12.17), PWM_cylinder (RN7.2)
PWM_CY3: Servo_buffer (U12.16), PWM_cylinder (RN7.3)
PWM_CY4: Servo_buffer (U12.15), PWM_cylinder (RN7.4)
PWM_IN1: Servo_buffer (U12.14), Servo (RN6.1)
PWM_IN2: Servo_buffer (U12.13), Servo (RN6.2)
PWM_IN3: Servo_buffer (U12.12), Servo (RN6.3)
PWM_IN4: Servo_buffer (U12.11), Servo (RN6.4)